# Altium schematic sheet Schematic_Capstone.SchDoc
size A; SheetNumber: 1; SheetTotal: 1
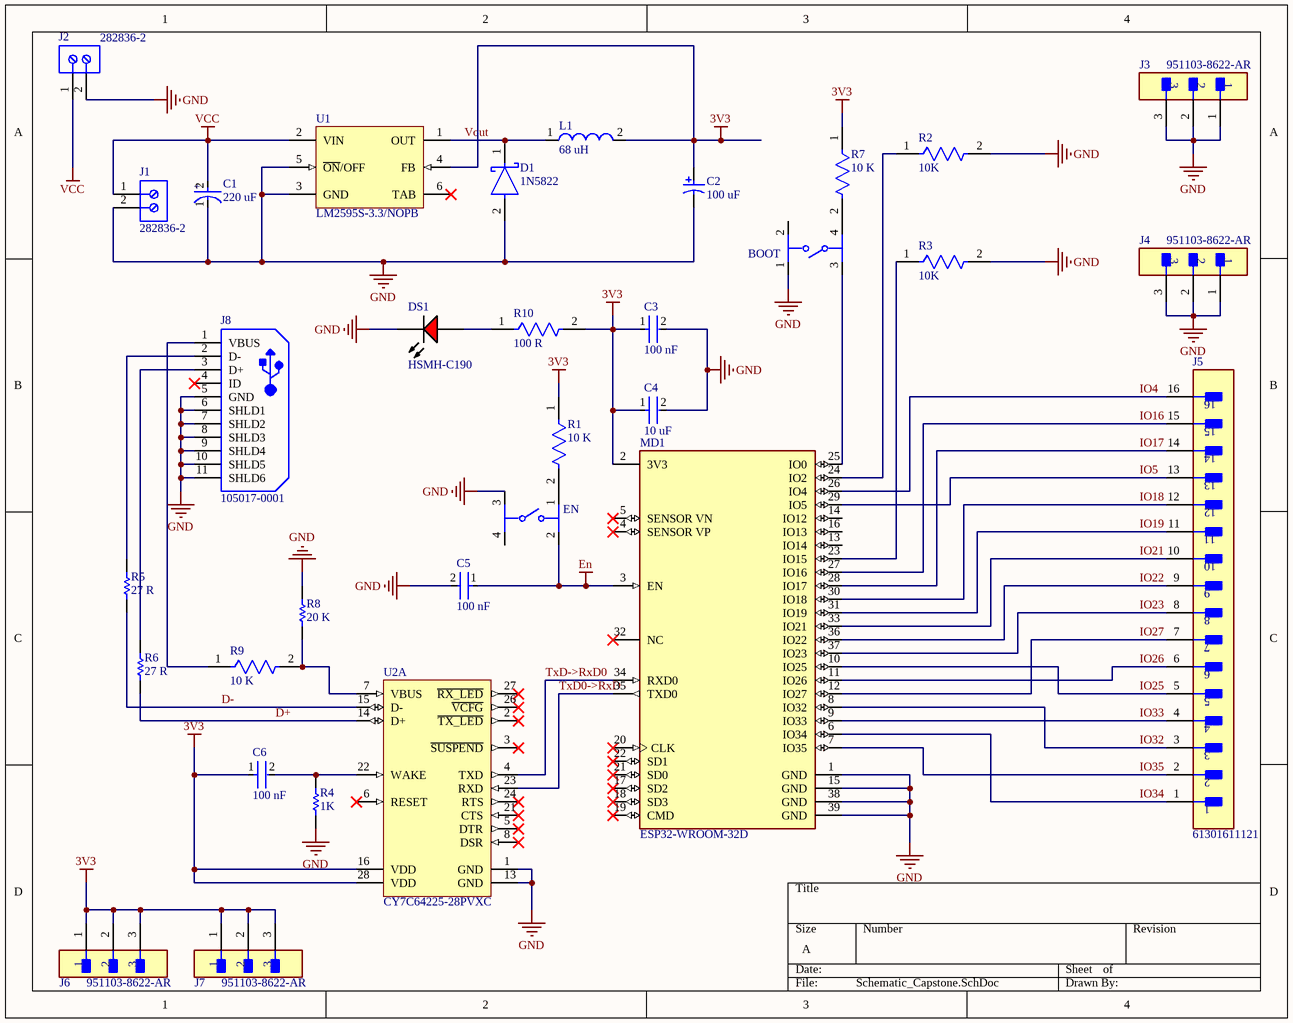
[diagram p0: Schematic_Capstone.SchDoc]

## Parts
BOOT  PTS645SM43SMTR92LFS  [FP-PTS645SM43SMTR92LFS-MFG]  (value not drawn)
C1  220 uF  [FP-860010473011-MFG]
C2  100 uF  [VISH-7343-31_N]
C3  100 nF  [FP-C0805C-DN-MFG]
C4  10 uF  [FP-C3225-250-0_45-MFG]
C5  100 nF  [FP-C0805C-DN-MFG]
C6  100 nF  [FP-C0805C-DN-MFG]
D1  1N5822  [FP-DO-201AD-MFG]
DS1  HSMH-C190  [AVAG-HSMX-C190_V]
EN  PTS645SM43SMTR92LFS  [FP-PTS645SM43SMTR92LFS-MFG]  (value not drawn)
J1  282836-2  [TECO-282836-2_V]
J2  282836-2  [TECO-282836-2_V]
J3  951103-8622-AR  [FP-951103-8622-AR-MFG]
J4  951103-8622-AR  [FP-951103-8622-AR-MFG]
J5  61301611121  [FP-61301611121-MFG]
J6  951103-8622-AR  [FP-951103-8622-AR-MFG]
J7  951103-8622-AR  [FP-951103-8622-AR-MFG]
J8  105017-0001  [USB-MICRO-B_V]
L1  68 uH  [WE-PD-L]
MD1  ESP32-WROOM-32D  [FP-ESP32-WROOM-32D-MFG]
R1  10 K  [FP-CRCW2010-e3-IPC_B]
R2  10K  [FP-CRCW2010-e3-IPC_B]
R3  10K  [FP-CRCW2010-e3-IPC_B]
R4  1K  [RESC1005X40X25NL05T05]
R5  27 R  [RESC3216X70X50NL05T20]
R6  27 R  [RESC3216X70X50NL05T20]
R7  10 K  [FP-CRCW2010-e3-IPC_B]
R8  20 K  [RESC1608X55X25ML10T15]
R9  10 K  [FP-CRCW2010-e3-IPC_B]
R10  100 R  [FP-CRCW0402-e3-IPC_C]
U1  LM2595S-3.3/NOPB  [KTT0005B_N]
U2  CY7C64225-28PVXC  [CYP-PVX28_L]  (part A of 2)

## Nets
3V3: C2.1 C3.1 C4.1 C6.1 J6.1 J6.2 J6.3 J7.1 J7.2 J7.3 L1.2 MD1.2(3V3) R1.1 R7.1 R10.2 U1.4(FB) U2.16(VDD) U2.28(VDD)
En: C5.1 EN.2 MD1.3(EN)
GND: BOOT.1 C1.1(C) C2.2 C3.2 C4.2 C5.2 D1.2(A) DS1.2(K) EN.3 J1.2 J2.2 J3.1 J3.2 J3.3 J4.1 J4.2 J4.3 J8.5(GND) J8.6(SHLD1) J8.7(SHLD2) J8.8(SHLD3) J8.9(SHLD4) J8.10(SHLD5) J8.11(SHLD6) MD1.1(GND) MD1.15(GND) MD1.38(GND) MD1.39(GND) R2.2 R3.2 R4.2 R8.2 U1.3(GND) U1.5(~{ON}/OFF) U2.1(GND) U2.13(GND)
VCC: C1.2(A) J1.1 J2.1 U1.2(VIN)
D+: R6.1 U2.14(D+)
D-: R5.2 U2.15(D-)
IO4: J5.16 MD1.26(IO4)
IO5: J5.13 MD1.29(IO5)
IO16: J5.15 MD1.27(IO16)
IO17: J5.14 MD1.28(IO17)
IO18: J5.12 MD1.30(IO18)
IO19: J5.11 MD1.31(IO19)
IO21: J5.10 MD1.33(IO21)
IO22: J5.9 MD1.36(IO22)
IO23: J5.8 MD1.37(IO23)
IO25: J5.5 MD1.10(IO25)
IO26: J5.6 MD1.11(IO26)
IO27: J5.7 MD1.12(IO27)
IO32: J5.3 MD1.8(IO32)
IO33: J5.4 MD1.9(IO33)
IO34: J5.1 MD1.6(IO34)
IO35: J5.2 MD1.7(IO35)
TxD0->RxD: MD1.35(TXD0) U2.23(RXD)
TxD->RxD0: MD1.34(RXD0) U2.4(TXD)
Vout: D1.1(C) L1.1 U1.1(OUT)
NetBOOT_3: BOOT.3 MD1.25(IO0)
NetBOOT_4: BOOT.4 R7.2
NetC6_2: C6.2 R4.1 U2.22(WAKE)
NetDS1_1: DS1.1(A) R10.1
NetEN_1: EN.1 R1.2
NetJ8_1: J8.1(VBUS) R9.1
NetJ8_2: J8.2(D-) R5.1
NetJ8_3: J8.3(D+) R6.2
NetMD1_23: MD1.23(IO15) R3.1
NetMD1_24: MD1.24(IO2) R2.1
NetR8_1: R8.1 R9.2 U2.7(VBUS)

Not connected (* = marked no-connect by the designer): BOOT 2; EN 4; J8 4(ID)*; MD1 4(SENSOR_VP)* 5(SENSOR_VN)* 13(IO14) 14(IO12) 16(IO13) 17(SD2)* 18(SD3)* 19(CMD)* 20(CLK)* 21(SD0)* 22(SD1)* 32(NC)*; U1 6(TAB)*; U2 2(~{TX_LED})* 3(~{SUSPEND})* 5(DTR)* 6(RESET)* 8(DSR)* 21(CTS)* 24(RTS)* 26(~{VCFG})* 27(~{RX_LED})*

## Notes on the sheet
- (in symbol CMP-207834-000007-1) +

## Library data of the parts
BOOT EN = CMP-2000-05160-2: SWITCH TACTILE SPST-NO 0.05A 12V; Contact Resistance: 100mR; Throw Configuration: SPST; Illumination Type: Non-Illuminated; Mechanical Life: 100000Cycles; Current Rating: 50mA; Switch Function: Off-Mom; Actuator Length: 0.85mm; Actuator Material: Nylon; Actuator Type: Standard; Operating Force: 160gf; Min Operating Temperature: -20°C; REACH SVHC: No SVHC; Termination: Gull Wing; Case/Package: SMD/SMT; Packaging: Tape and Reel; Mount: Surface Mount; Voltage Rating (DC): 12V; Orientation: Straight; Lead Free: Lead Free; Contact Material: Silver; Color: Black; Max Current Rating: 50mA; Contact Plating: Silver; Depth: 9mm; Package Quantity: 1; Max Voltage Rating (DC): 12V; Length: 6mm; Max Operating Temperature: 60°C
C1 = CMP-207834-000007-1: CAP 220 UF 20% 25 V; Life (Hours): 2000Hour; Voltage Rating: 25V; Polarity: Polar; Material: Aluminium; Ripple Current: 310mA; Capacitance: 220uF; Height: 11mm; Tolerance: 20%; Min Operating Temperature: -40°C; Diameter: 6.3mm; Series: WCAP-ATG8; Max Operating Temperature: 85°C; Mount: Through Hole; Lead Pitch: 0.098inch; Packaging: Tape and Reel; Case/Package: Radial; Voltage Rating (DC): 25V; RoHS Compliant: Yes; Height - Seated (Max): 0.492inch; Package Quantity: 1500
C2 = CMP-1666-00024-1: Solid Tantalum Chip Capacitor, 100 uF, +/- 10%, 10 V, -55 to 125 degC, 2917 (7343 Metric), RoHS, Tape and Reel; Voltage Rating (DC): 50 V; Case\Package: 0603; Resistance: 1.2 kohm; Power Rating: 100 mW; Tolerance: 1%; ComponentLink2URL: http://www.vishay.com/docs/40002/293d.pdf; Max Operating Temperature: 155 degC; Length: 1.6 mm; Mount: Surface Mount; Pins: 2; RoHSCompliant: true; ComponentLink1URL: http://www.vishay.com/; DatasheetVersion: Aug-16; REACH SVHC: No SVHC; Height: 0.45 mm; Width: 0.8 mm; Min Operating Temperature: -55 degC; ComponentLink2Description: Datasheet; Case Code (Metric): 1608; Case Code (Imperial): 0603; Packaging: Tape and Reel; PackageReference: 7343-31; Package Quantity: 200; Voltage Rating: 50 V; PackageDescription: 2-Pin Surface Mount Device, Body 7.3 x 4.3 mm; ComponentLink1Description: Manufacturer URL
C3 C5 C6 = CMP-2007-00279-2: CAP CER 0.1UF 50V X7R 0805; Manufacturer Part Number: C0805C104K5RACTU; Manufacturer: KEMET; Value: 0.10 μF; Tolerance: 0.1; Temperature Coefficient: 30ppm/°C; Material: Ceramic; Device Class L2: Capacitors; Temperature Range Low: -55°C; Voltage Rating: 50 V; Digikey Description: CAP CER 0.1UF 50V X7R 0805; Category: Cap; ComponentLink2Description: Datasheet; Octopart: https://octopart.com/c0805c104k5ractu-kemet-143926; RoHS: TRUE; ComponentLink2URL: https://content.kemet.com/datasheets/KEM_C1003_C0G_SMD.pdf; Temperature Characteristic: X7R; Temperature: -55°C to +125°C; Height: 0.88mm; Temperature Range High: +125°C; Device Class L1: Passive Components; Automotive: No; Lead Free: Yes; Ipc Land Pattern Name: CAPC200125X78; Device Class L3: Ceramic Capacitors; Mouser Description: Cap Ceramic 0.1uF 50V X7R 10% SMD 2.0 x 1.2 mm 125 C Paper T/R; Capacitance: 0.10 μF; Package: C0805C-DN
C4 = CMP-08246-007262-1: COMMERCIAL GRADE GENERAL PURPOSE
D1 = CMP-12187-000025-1: DIODE SCHOTTKY 40V 3A DO201AD; Manufacturer: STMicroelectronics; Max Junction Temp: +150°C; Peak Reverse Current: 2mA; Max Surge Forward Current: 80A; Temperature Range High: +150°C; Automotive: No; RoHS: TRUE; ComponentLink2Description: Datasheet; Manufacturer Part Number: 1N5822; Lead Free: Yes; Octopart: https://octopart.com/1n5822-stmicroelectronics-323225; Device Class L2: Diodes; Max Repetitive Reverse Voltage: 40V; Temperature: to +150°C; Height: 5.3mm; Category: Diode; Digikey Description: DIODE SCHOTTKY 40V 3A DO201AD; ComponentLink2URL: https://www.st.com/resource/en/datasheet/1n5822.pdf; Device Class L3: Schottky Diodes; Device Class L1: Discrete Semiconductors; Forward Current: 3A; Mouser Description: Schottky Diodes & Rectifiers Vr/40V Io/3A BULK; Package: DO-201AD
DS1 = CMP-1744-00004-1: LED Uni-Color Red, 65 mW, 20 mA, -40 to 85 degC, 2-Pin SMD, RoHS, Tape and Reel; Connector Type: USB; Gender: Male; Current Rating: 1 A; Length: 7.5 mm; Lead Pitch: 0.65 mm; PackageReference: HSMX-C190; Package Quantity: 2000; Max Operating Temperature: 85 degC; PackageDescription: 2-Pin Surface Mount Device, Body 1.6 x 0.8 mm, Height 0.9 mm; ComponentLink3Description: Package Specification; Mount: Surface Mount; Min Operating Temperature: -30 degC; ComponentLink3URL: http://www.fairchildsemi.com/dwg/MA/MA03D.pdf; ComponentLink1Description: Manufacturer URL; Contact Material: Copper; Pins: 5; Width: 5.6 mm; ComponentLink2Description: Datasheet; RoHSCompliant: true; DatasheetVersion: Mar-12; Height: 2.8 mm; Packaging: Tape and Reel; Contact Plating: Gold; ComponentLink1URL: http://www.avagotech.com/; REACH SVHC: No SVHC; ComponentLink2URL: http://docs.avagotech.com/docs/AV02-0551EN
J1 J2 = CMP-1684-00017-1: Female Header, Pitch 5 mm, 1 x 2 Position, Height 10 mm, Tail Length 3.5 mm, Rohs, Bulk; Manufacturer: TE Connectivity; Wire Gauge: 16-30AWG; Product Training Modules: Wire-to-BoardEurostyleTerminalBlocks; Clamp Material - Plating: Brass-NickelPlated; Voltage: 300V; Mating Orientation: HorizontalwithBoard; Current: 13.5A; Pitch: 0.197"(5.00mm); Screw Thread: M3; 3D Model: 282836-2.pdf; Other Names: 5ULV-02B / A98076; Dynamic Catalog: BuchananSeries; Number of Levels: 1; Torque - Screw: 0.68Nm(6Lb-In); Featured Product: EurostyleTerminalBlockConnectors; Positions Per Level: 2; Wire Termination: Screw-RisingCageClamp; Datasheet URL: http://www.te.com.cn/commerce/DocumentDelivery/DDEController?Action=showdoc&DocId=Catalog+Section%7F1308389_EUROSTYLE_TERMINAL_BLOCKS%7F0607%7Fpdf%7FEnglish%7FENG_CS_1308389_EUROSTYLE_TERMINAL_BLOCKS_0607.pdf%7F282836-2; Color: Green; Family: TerminalBlocks-WiretoBoard; RoHS Information: 282836-2StatementofCompliance; Standard Package: 300; Contact Material - Plating: Brass-TinPlated; Manufacturer URL: http://www.te.com; Housing Material: Polyamide(PA66),Nylon6/6; Features: Interlocking(Side); Package Description: Female Header, Pitch 5 mm, 1 x 2 Position, Height 10 mm, Tail Length 3.5 mm; Mounting Type: ThroughHole; Package Reference: THD; Packaging: Bulk; Series: Buchanan; Category: Connectors,Interconnects; Screw Material - Plating: Brass-NickelPlated
J3 J4 J6 J7 = CMP-05379-000003-1: CONN HEADER VERT 3POS 2MM; Manufacturer: 3M; Conn Gender: Male; Current Rating: 2A; Number Of Contacts: 3; Conn Orientation: Straight; Description: CONN HEADER 3POS 2MM VERT T/H; Digikey Description: CONN HEADER VERT 3POS 2MM; Device Class L3: unset; Category: Conn; Height: 6.3mm; Manufacturer Part Number: 951103-8622-AR; RoHS: TRUE; Contact Material: Gold,Nickel; ComponentLink2Description: Datasheet; Temperature Range Low: -55°C; Device Class L1: Connectors; Pitch: 2mm; Mouser Description: Header; PinStrip; CopperAlloy; HighTempThermoplastic; 3Cnts; 1A; RtAngle; 951Series; Octopart: https://octopart.com/951103-8622-ar-3m-14400669; Package: 951103-8622-AR; Lead Free: Yes; Device Class L2: Headers and Wire Housings; Temperature Range High: +125°C; ComponentLink2URL: http://multimedia.3m.com/mws/media/1400506O/3m-pin-strip-header-951-series-78-5100-2653-3.pdf; Automotive: No; Temperature: -55°C to +125°C; Number Of Rows: 1
J5 = CMP-1502-01095-2: CONN HEADER VERT 16POS 2.54MM; Pitch: 0.1inch; Voltage Rating: 250V; Number of Contacts: 16; Gender: Male; Flammability Rating: UL94 V-0; Fastening Type: Pull; Contact Plating: Gold; Termination: Solder; Contact Type: Male Pin; Number of Rows: 1; Max Operating Temperature: 105°C; Insulation Color: Black; Min Operating Temperature: -40°C; Mount: Through Hole; Contact Mating Length: 0.236inch; Contact Finish - Mating: GOLD; Insulation Material: Nylon; Color: Black; Packaging: Bulk; Number of Positions: 16; RoHS Compliant: Yes; Series: WR-PHD; Connector Type: Header; Contact Material: Copper Alloy; Contact Shape: Square
J8 = CMP-2000-05827-1: Micro-USB B Receptacle, Right Angle, Bottom Mount, Surface Mount, with Solder Tabs, -30 to 85 degC, 5-Pin USB, RoHS, Tape and Reel; Manufacturer: Molex; Featured Product: Micro-USBConnectorsUSBConnectors; Other Names: WM1399DKR; Package Version: Rev. F, 12/2012; Number of Contacts: 5; Connector Type: USB-microB; Catalog Drawings: 1050170001; 3D Model: 105017-0001.stp; Mating Products: WM17145-ND-CABLEMICROUSBBTOSTDA1.0MWM17147-ND-CABLEMICROUSBBTOSTDA2.0MWM17146-ND-CABLEMICROUSBBTOSTDA1.5M; PCN Assembly/Origin: ResinSupplier21/Oct/2015; Voltage - Max: 30V; Online Catalog: Molex-MicroUSB; Manufacturer URL: http://www.molex.com/; Package Description: 5-Leads USB, Micro B, Body 7.5 x 5 mm, Pitch 0.65 mm; Datasheet URL: http://www.molex.com/elqNow/elqRedir.htm?ref=http://www.molex.com/webdocs/datasheets/pdf/en-us/1050170001_IO_CONNECTORS.pdf; Ingress Protection: -; Datasheet Version: 03/2016; Mounting Type: BoardCutout,SurfaceMount,RightAngle; Circuits: 5; Standard Package: 1; Package Reference: MICRO-B; Package URL: http://www.molex.com/pdm_docs/sd/1050170001_sd.pdf; Category: Connectors,Interconnects; Series: -; RoHS Information: 1050170001CertofCompliance; Features: Shielded,SolderRetention; Family: USB,DVI,HDMIConnectors; Specifications: -; Gender: Receptacle; Packaging: Digi-Reel®; Mounting Technology: SurfaceMount
L1 = CMP-0227-00736-1: SMD-Shielded Power Inductor WE-PD, L = 68.0 µH; Inductance: 68.0 ÂµH; PackageDescription: SMD Inductor, 2-Leads, Body 12.0 x 12.0 mm; ComponentLink2URL: http://www.we-online.de/katalog/media/pdf/744771168.pdf; PackageReference: WE-PD-L; PackageVersion: 2006; ComponentLink1URL: http://www.we-online.com; ComponentLink2Description: Datasheet; DatasheetVersion: ver 6, Jun-2005; ComponentLink1Description: Manufacturer Link
MD1 = CMP-194065-000003-1: WIFI MODULE 32MBITS SPI FLASH; Manufacturer: Espressif Systems; Max Supply Voltage: 3.6V; Nominal Supply Current: 500mA; Max Frequency: 2484MHz; Number Of Adc Channels: 16; Number Of Gpio: 32; Interface: I2C,SPI,UART,Ethernet,I2S,Other; Data Rate: 150Mbits/s; Min Supply Voltage: 3V; Bandwidth: 72MHz; Sensitivity: -98dBm; Octopart: https://octopart.com/esp32-wroom-32d-espressif+systems-91040050; Package: ESP32-WROOM-32D; ComponentLink2URL: https://www.espressif.com/sites/default/files/documentation/esp32-wroom-32d_esp32-wroom-32u_datasheet_en.pdf; Lead Free: Yes; Category: UNK; Mouser Description: Wi-Fi/BT BLE Module ESP32-D0WD, SPI Flash, UART, P; Device Class L1: Integrated Circuits (ICs); RoHS: TRUE; Temperature Range Low: -40°C; ComponentLink2Description: Datasheet; Digikey Description: WIFI MODULE 32MBITS SPI FLASH; Height: 3.2mm; Temperature: -40°C to +85°C; Manufacturer Part Number: ESP32-WROOM-32D; Device Class L3: Transceivers; Device Class L2: RF Semiconductors and Devices; Temperature Range High: +85°C; Automotive: No
R1-R3 R7 R9 = CMP-1017-00623-2: RES Thick Film, 10kΩ, 1%, 0.75W, 100ppm/°C, 2010; Voltage Rating: 400V; Resistance: 10kR; Power Rating: 750mW; Width: 2.5mm; Case Code (Metric): 5025; Termination: SMD/SMT; Depth: 2.5mm; Contact Plating: Tin; Package Quantity: 4000; Temperature Coefficient: 100ppm/°C; Composition: Thick Film; Case/Package: 2010; Max Operating Temperature: 155°C; Military Standard: Not; Length: 5mm; Weight: 0.000899oz; Height: 0.6mm; Min Operating Temperature: -55°C; Tolerance: 1%; Lead Free: Lead Free; Packaging: Tape and Reel; Case Code (Imperial): 2010; Radiation Hardening: No; Voltage Rating (DC): 400V
R4 = CMP-2002-00432-1: Manufacturer: Panasonic; Part Number: ERJ-2GEJ102X
R5 R6 = CMP-2003-00830-1: Manufacturer: Panasonic; Part Number: ERJ8ENF27R0V
R8 = CMP-2000-04177-1: Part Number: RC0603FR-1020KL; Manufacturer: Yageo
R10 = CMP-1011-00397-3: RES Thick Film, 100Ω, 1%, 0.063W, 100ppm/°C, 0402; Max Power Dissipation: 63mW; Voltage Rating: 50V; Resistance: 100R; Package Quantity: 10; Lead Free: Lead Free; Termination: SMD/SMT; Case Code (Metric): 1005; Number of Terminations: 2; Composition: Thick Film; Voltage Rating (DC): 50V; Min Operating Temperature: -55°C; Case/Package: 0402; Radiation Hardening: No; Max Operating Temperature: 155°C; Temperature Coefficient: 100ppm/°C; Military Standard: Not; Length: 1mm; Mount: Surface Mount; Power Rating: 63mW; Weight: 2.3E-05oz; Working Voltage: 50V; Features: Automotive AEC-Q200; Depth: 0.5mm; Packaging: Tape and Reel; Tolerance: 1%; Height: 0.35mm; Case Code (Imperial): 0402; Width: 0.02inch; Contact Plating: Tin
U1 = CMP-0069-00229-3: SIMPLE SWITCHER® Power Converter 150 KHz 1A Step-Down Voltage Regulator, 5-pin TO-263, Pb-Free; Manufacturer: Texas Instruments; PackageTopMarking: NSUZXYTTE#*LM2595S*-3.3 P+; PowerWise: N; PackageReference: KTT0005B; RoHS: Y; Code_JEDEC: MO-169-AB; PackageDescription: TO-263, Molded, .400 x .390 x .180in, 5 Lead, .067in Pitch, Surface Mount; CompType: Switcher; ComponentLink1Description: Datasheet URL; PinCount: 5; ComponentLink1URL: http://www.ti.com/general/docs/lit/getliterature.tsp?genericPartNumber=LM2595&fileType=pdf
U2 = CMP-0967-00143-1: USB-to-UART Bridge Controller, 3 to 5.25 V, 0 to 70 degC, 28-Pin SSOP (PVX28), Tube; Manufacturer: Cypress; Max. Operating Voltage (V): 5.25; Min. Operating Voltage (V): 3; Memory Architecture: Flash; Mounting Technology: Surface Mount; Max. Operating Temp. (degreesC): 70; DatasheetVersion: Rev. *D; Packing: Tube; ComponentLink2URL: http://www.cypress.com/?docID=48153; PackageReference: PVX28; PartNumber: CY7C64225-28PVXC; PackageDescription: 28-Pin Super Small Outline Package, Body 10.2 x 5.3 mm, Pitch 0.65 mm; RoHS: Pb-Free; ComponentLink3Description: Package Specification; Min. Operating Temp. (degreesC): 0; ComponentLink1URL: http://www.cypress.com/; ComponentLink2Description: Datasheet; ComponentLink1Description: Manufacturer URL; PackageVersion: Rev. *C, 10/2001; ComponentLink3URL: http://www.cypress.com/?docID=1371